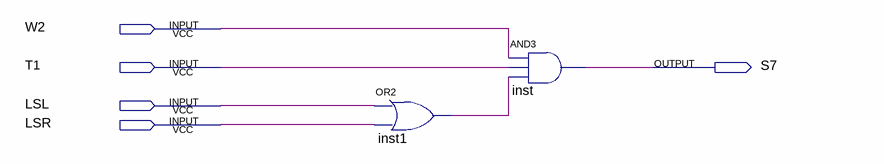
[diagram p0: schematic sheet]
// Quartus schematic S7.bdf as structural Verilog: 2 symbols, 5 pins
module S7 (
  input  W2,
  input  T1,
  input  LSL,
  input  LSR,
  output S7
);

  wire inst1_out;

  or inst1 (inst1_out, LSL, LSR);
  and inst (S7, W2, T1, inst1_out);
endmodule
